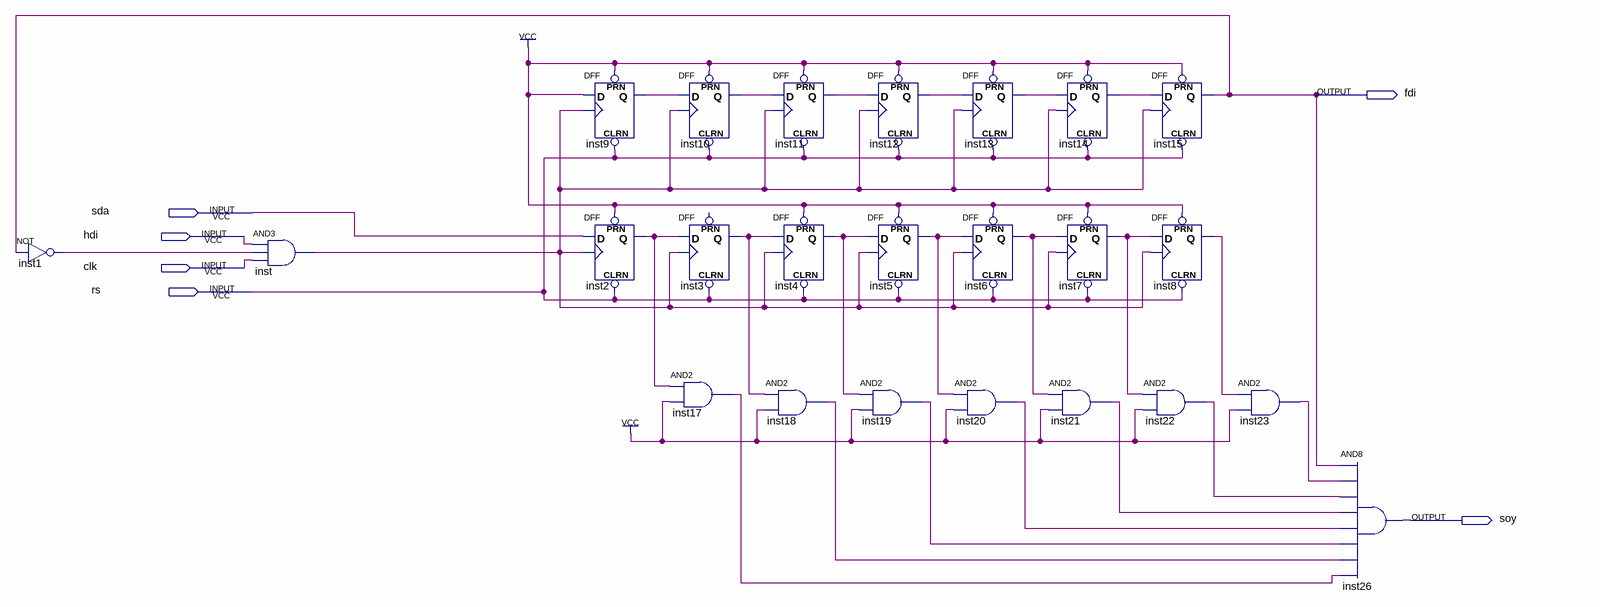
[diagram p0: schematic sheet]
// Quartus schematic dir.bdf as structural Verilog: 24 symbols, 6 pins
module dir (
  input  sda,
  input  hdi,
  input  clk,
  input  rs,
  output fdi,
  output soy
);

  wire inst1_out, inst2_q, inst3_q, inst4_q, inst5_q, inst6_q, inst7_q, inst8_q, inst9_q, inst10_q, inst11_q,
       inst12_q, inst13_q, inst14_q, inst17_out, inst18_out, inst19_out, inst20_out, inst21_out, inst22_out,
       inst23_out, inst_out;

  not inst1 (inst1_out, fdi);
  and inst (inst_out, hdi, inst1_out, clk);
  DFF inst9 (.CLRN(rs), .CLK(inst_out), .D(1'b1), .PRN(1'b1), .Q(inst9_q));
  DFF inst2 (.CLRN(rs), .CLK(inst_out), .D(sda), .PRN(1'b1), .Q(inst2_q));
  and inst17 (inst17_out, inst2_q, 1'b1);
  DFF inst10 (.CLRN(rs), .CLK(inst_out), .D(inst9_q), .PRN(1'b1), .Q(inst10_q));
  DFF inst3 (.CLRN(rs), .CLK(inst_out), .D(inst2_q), .Q(inst3_q));  // open: PRN
  DFF inst11 (.CLRN(rs), .CLK(inst_out), .D(inst10_q), .PRN(1'b1), .Q(inst11_q));
  DFF inst4 (.CLRN(rs), .CLK(inst_out), .D(inst3_q), .PRN(1'b1), .Q(inst4_q));
  and inst18 (inst18_out, inst3_q, 1'b1);
  and inst19 (inst19_out, inst4_q, 1'b1);
  DFF inst12 (.CLRN(rs), .CLK(inst_out), .D(inst11_q), .PRN(1'b1), .Q(inst12_q));
  DFF inst5 (.CLRN(rs), .CLK(inst_out), .D(inst4_q), .PRN(1'b1), .Q(inst5_q));
  DFF inst13 (.CLRN(rs), .CLK(inst_out), .D(inst12_q), .PRN(1'b1), .Q(inst13_q));
  DFF inst6 (.CLRN(rs), .CLK(inst_out), .D(inst5_q), .PRN(1'b1), .Q(inst6_q));
  and inst20 (inst20_out, inst5_q, 1'b1);
  and inst21 (inst21_out, inst6_q, 1'b1);
  DFF inst14 (.CLRN(rs), .CLK(inst_out), .D(inst13_q), .PRN(1'b1), .Q(inst14_q));
  DFF inst7 (.CLRN(rs), .CLK(inst_out), .D(inst6_q), .PRN(1'b1), .Q(inst7_q));
  DFF inst15 (.CLRN(rs), .CLK(inst_out), .D(inst14_q), .PRN(1'b1), .Q(fdi));
  DFF inst8 (.CLRN(rs), .CLK(inst_out), .D(inst7_q), .PRN(1'b1), .Q(inst8_q));
  and inst22 (inst22_out, inst7_q, 1'b1);
  and inst23 (inst23_out, inst8_q, 1'b1);
  and inst26 (soy, fdi, inst23_out, inst22_out, inst21_out, inst20_out, inst19_out, inst18_out, inst17_out);
endmodule
